# EAGLE design BLDC2 (EAGLE 9.6.2)
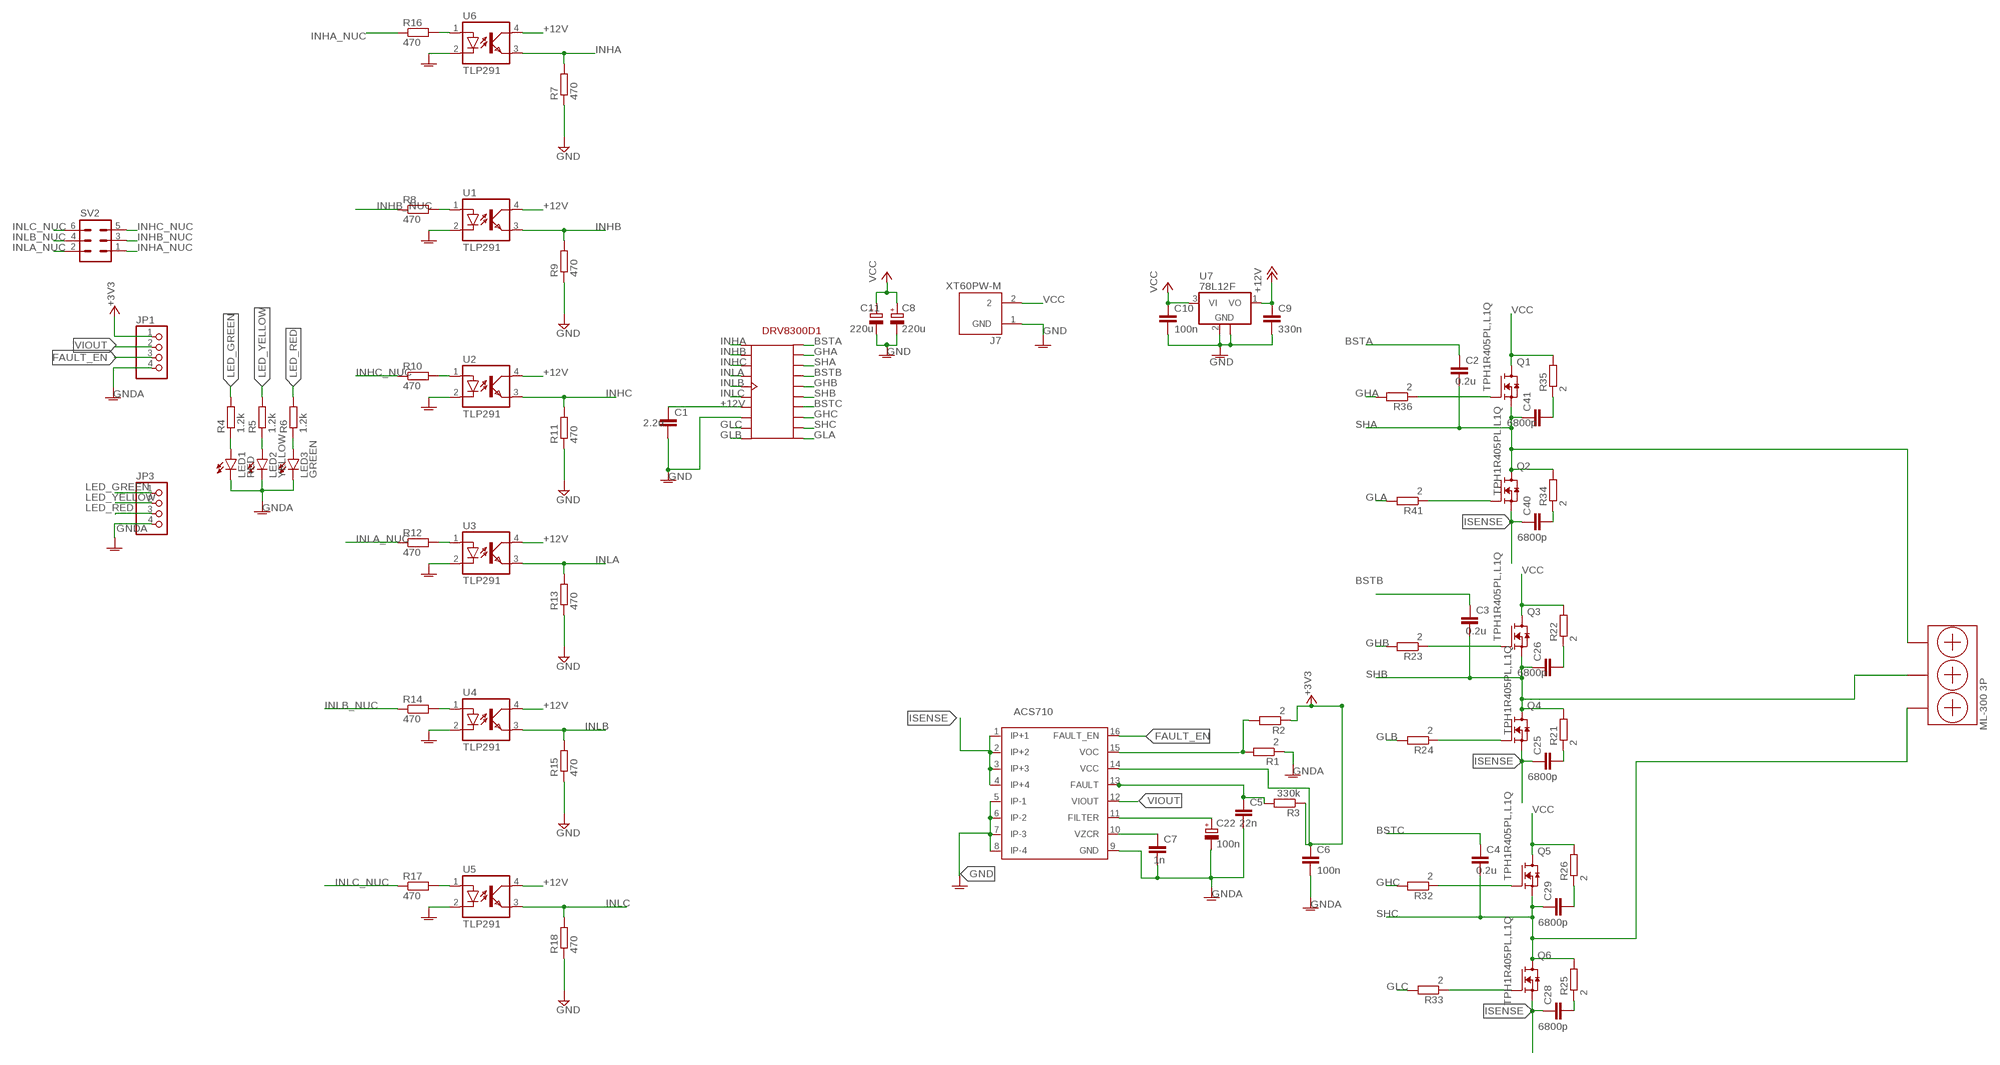
[diagram p0: schematic, sheet 1]

## Parts
C1  2.2u  C-EUC1206  [C1206]
C2  0.2u  C-EUC1206  [C1206]
C3  0.2u  C-EUC1206  [C1206]
C4  0.2u  C-EUC1206  [C1206]
C5  22n  C-EUC0603  [C0603]
C6  100n  C-EUC0603  [C0603]
C7  1n  C-EUC0603  [C0603]
C8  220u  CPOL-EUE5-10.5  [E5-10,5]
C9  330n  C-EUC0603  [C0603]
C10  100n  C-EUC0603  [C0603]
C11  220u  CPOL-EUE5-10.5  [E5-10,5]
C22  100n  CPOL-EUE2.5-5  [E2,5-5]
C25  6800p  C-EUC0603  [C0603]
C26  6800p  C-EUC0603  [C0603]
C28  6800p  C-EUC0603  [C0603]
C29  6800p  C-EUC0603  [C0603]
C40  6800p  C-EUC0603  [C0603]
C41  6800p  C-EUC0603  [C0603]
DRV8300D1  DRV8300D  [DRV8300D]
J7  XT60PW-M  [AMASS_XT60PW-M]
JP1  PINHD-1X4  [1X04]
JP3  PINHD-1X4  [1X04]
LED1  RED  LEDCHIP-LED0603  [CHIP-LED0603]
LED2  YELLOW  LEDCHIP-LED0603  [CHIP-LED0603]
LED3  GREEN  LEDCHIP-LED0603  [CHIP-LED0603]
ML-300-3P1  ML-300-3P  [ML300-3P]
Q1  TPH1R405PL,L1Q  [SOPADVANCE]
Q2  TPH1R405PL,L1Q  [SOPADVANCE]
Q3  TPH1R405PL,L1Q  [SOPADVANCE]
Q4  TPH1R405PL,L1Q  [SOPADVANCE]
Q5  TPH1R405PL,L1Q  [SOPADVANCE]
Q6  TPH1R405PL,L1Q  [SOPADVANCE]
R1  2  R-EU_R0603  [R0603]
R2  2  R-EU_R0603  [R0603]
R3  330k  R-EU_R0603  [R0603]
R4  1.2k  R-EU_R0603  [R0603]
R5  1.2k  R-EU_R0603  [R0603]
R6  1.2k  R-EU_R0603  [R0603]
R7  470  R-EU_R0603  [R0603]
R8  470  R-EU_R0603  [R0603]
R9  470  R-EU_R0603  [R0603]
R10  470  R-EU_R0603  [R0603]
R11  470  R-EU_R0603  [R0603]
R12  470  R-EU_R0603  [R0603]
R13  470  R-EU_R0603  [R0603]
R14  470  R-EU_R0603  [R0603]
R15  470  R-EU_R0603  [R0603]
R16  470  R-EU_R0603  [R0603]
R17  470  R-EU_R0603  [R0603]
R18  470  R-EU_R0603  [R0603]
R21  2  R-EU_R0603  [R0603]
R22  2  R-EU_R0603  [R0603]
R23  2  R-EU_R0603  [R0603]
R24  2  R-EU_R0603  [R0603]
R25  2  R-EU_R0603  [R0603]
R26  2  R-EU_R0603  [R0603]
R32  2  R-EU_R0603  [R0603]
R33  2  R-EU_R0603  [R0603]
R34  2  R-EU_R0603  [R0603]
R35  2  R-EU_R0603  [R0603]
R36  2  R-EU_R0603  [R0603]
R41  2  R-EU_R0603  [R0603]
SV2  MA03-2  [MA03-2]
U1  TLP291  [MINI-FLAT-4]
U2  TLP291  [MINI-FLAT-4]
U3  TLP291  [MINI-FLAT-4]
U4  TLP291  [MINI-FLAT-4]
U5  TLP291  [MINI-FLAT-4]
U6  TLP291  [MINI-FLAT-4]
U7  78L12F  [SOT89]
U$1  ACS710  [ACS710]

## Nets
+3V3: C6.1 JP1.1 R2.1 R3.1 U$1.14(VCC)
+12V: C1.1 C9.1 DRV8300D1.GVDD U1.4(COL) U2.4(COL) U3.4(COL) U4.4(COL) U5.4(COL) U6.4(COL) U7.1(VO)
AHG1 [gates]: Q1.4(G) R36.1
AHG3 [gates]: Q3.4(G) R23.1
AHG4 [gates]: Q5.4(G) R32.1
ALG1 [gates]: Q2.4(G) R41.1
ALG3 [gates]: Q4.4(G) R24.1
ALG4 [gates]: Q6.4(G) R33.1
BSTA [INS]: C2.1 DRV8300D1.BSTA
BSTB [INS]: C3.1 DRV8300D1.BSTB
BSTC [INS]: C4.1 DRV8300D1.BSTC
FAULT_EN: JP1.3 U$1.16(FAULT_EN)
GHA [INS]: DRV8300D1.GHA R36.2
GHB [INS]: DRV8300D1.GHB R23.2
GHC [INS]: DRV8300D1.GHC R32.2
GLA [INS]: DRV8300D1.GLA R41.2
GLB [INS]: DRV8300D1.GLB R24.2
GLC [INS]: DRV8300D1.GLC R33.2
GND: C1.2 C8.- C9.2 C10.2 C11.- DRV8300D1.GND J7.1(GND) R7.1 R9.1 R11.1 R13.1 R15.1 R18.1 U7.2(GND) U7.2@1(GND) U$1.5(IP-1) U$1.6(IP-2) U$1.7(IP-3) U$1.8(IP-4) ; supply symbol labelled GNDA
GNDA: C5.2 C6.2 C7.2 C22.- JP1.4 JP3.4 LED1.C LED2.C LED3.C R1.1 U1.2(C) U2.2(C) U3.2(C) U4.2(C) U5.2(C) U6.2(C) U$1.9(GND)
INHA [INS]: DRV8300D1.INHA R7.2 U6.3(EMIT)
INHA_NUC: R16.1 SV2.1
INHB [INS]: DRV8300D1.INHB R9.2 U1.3(EMIT)
INHB_NUC: R8.1 SV2.3
INHC [INS]: DRV8300D1.INHC R11.2 U2.3(EMIT)
INHC_NUC: R10.1 SV2.5
INLA [INS]: DRV8300D1.INLA R13.2 U3.3(EMIT)
INLA_NUC: R12.1 SV2.2
INLB [INS]: DRV8300D1.INLB R15.2 U4.3(EMIT)
INLB_NUC: R14.1 SV2.4
INLC [INS]: DRV8300D1.INLC R18.2 U5.3(EMIT)
INLC_NUC: R17.1 SV2.6
ISENSE: C25.1 C28.1 C40.1 Q2.1(S) Q2.2(S) Q2.3(S) Q4.1(S) Q4.2(S) Q4.3(S) Q6.1(S) Q6.2(S) Q6.3(S) U$1.1(IP+1) U$1.2(IP+2) U$1.3(IP+3) U$1.4(IP+4)
LED_GREEN: JP3.1 R4.2
LED_RED: JP3.3 R6.2
LED_YELLOW: JP3.2 R5.2
N$1: LED1.A R4.1
N$2: LED2.A R5.1
N$3: R1.2 R2.2 U$1.15(VOC)
N$4: C5.1 R3.2 U$1.13(FAULT)
N$5: C7.1 U$1.10(VZCR)
N$6: LED3.A R6.1
N$7: R8.2 U1.1(A)
N$8: R10.2 U2.1(A)
N$9: R12.2 U3.1(A)
N$10: R14.2 U4.1(A)
N$11: R17.2 U5.1(A)
N$17: C22.+ U$1.11(FILTER)
N$25: R16.2 U6.1(A)
N$36: C25.2 R21.1
N$37: C26.2 R22.1
N$39: C28.2 R25.1
N$40: C29.2 R26.1
N$42: C40.2 R34.1
N$43: C41.2 R35.1
SHA [gates]: C2.2 C41.1 DRV8300D1.SHA ML-300-3P1.P$1 Q1.1(S) Q1.2(S) Q1.3(S) Q2.5(D) Q2.6(D) Q2.7(D) Q2.8(D) Q2.9(D) R34.2
SHB [gates]: C3.2 C26.1 DRV8300D1.SHB ML-300-3P1.P$3 Q3.1(S) Q3.2(S) Q3.3(S) Q4.5(D) Q4.6(D) Q4.7(D) Q4.8(D) Q4.9(D) R21.2
SHC [INS]: C4.2 C29.1 DRV8300D1.SHC ML-300-3P1.P$5 Q5.1(S) Q5.2(S) Q5.3(S) Q6.5(D) Q6.6(D) Q6.7(D) Q6.8(D) Q6.9(D) R25.2
VCC: C8.+ C10.1 C11.+ J7.2 Q1.5(D) Q1.6(D) Q1.7(D) Q1.8(D) Q1.9(D) Q3.5(D) Q3.6(D) Q3.7(D) Q3.8(D) Q3.9(D) Q5.5(D) Q5.6(D) Q5.7(D) Q5.8(D) Q5.9(D) R22.2 R26.2 R35.2 U7.3(VI)
VIOUT: JP1.2 U$1.12(VIOUT)

## Library data of the parts
C1-C7 C9 C10 C25 C26 C28 C29 C40 C41 = rcl:C-EU: CAPACITOR, European symbol; SPICEPREFIX: C
C8 C11 C22 = rcl:CPOL-EU: POLARIZED CAPACITOR, European symbol; SPICEPREFIX: C
DRV8300D1 = DRV8300D:DRV8300D
J7 = con-xt:XT60PW-M; AVAILABILITY: Unavailable; MF: AMASS; MP: XT60PW-M; PACKAGE: Package Analog Devices; PRICE: None
JP1 JP3 = pinhead:PINHD-1X4: PIN HEADER
LED1-LED3 = led:LED: LED OSRAM: - CHIPLED LG R971, LG N971, LY N971, LG Q971, LY Q971, LO R971, LY R971 LH N974, LH R974 LS Q976, LO Q976, LY Q976 LO Q996 - Hyper CHIPLED LW Q18S LB Q993, LB Q99A, LB R99A - SideLED LS A670, LO A670, LY A670, LG A670, LP A670 LB A673, LV A673, LT A673, LW A673 LH A674 LY A675 LS A676, LA A676, LO A676, LY A676, LW A676 LS A679, LY A679, LG A679 - Hyper Micro SIDELED® LS Y876, LA Y876, LO Y876, LY Y876 LT Y87S - SmartLED LW L88C, LW L88S LB L89C, LB L89S, LG L890 LS L89K, LO L89K, LY L89K LS L896, LA L896, LO L896, LY L896 - TOPLED LS T670, LO T670, LY T670, LG T670, LP T670 LSG T670, LSP T670, LSY T670, LOP T670, LYG T670 LG T671, LOG T671, LSG T671 LB T673, LV T673, LT T673, LW T673 LH T674 LS T676, LA T676, LO T676, LY T676, LB T676, LH T676, LSB T676, LW T676 LB T67C, LV T67C, LT T67C, LS T67K, LO T67K, LY T67K, LW E67C LS E67B, LA E67B, LO E67B, LY E67B, LB E67C, LV E67C, LT E67C LW T67C LS T679, LY T679, LG T679 LS T770, LO T770, LY T770, LG T770, LP T770 LB T773, LV T773, LT T773, LW T773 LH T774 LS E675, LA E675, LY E675, LS T675 LS T776, LA T776, LO T776, LY T776, LB T776 LHGB T686 LT T68C, LB T68C - Hyper Mini TOPLED® LB M676 - Mini TOPLED Santana® LG M470 LS M47K, LO M47K, LY M47K Source: http://www.osram.convergy.de LUXEON: - LUMILED® LXK2-PW12-R00, LXK2-PW12-S00, LXK2-PW14-U00, LXK2-PW14-V00 LXK2-PM12-R00, LXK2-PM12-S00, LXK2-PM14-U00 LXK2-PE12-Q00, LXK2-PE12-R00, LXK2-PE12-S00, LXK2-PE14-T00, LXK2-PE14-U00 LXK2-PB12-K00, LXK2-PB12-L00, LXK2-PB12-M00, LXK2-PB14-N00, LXK2-PB14-P00, LXK2-PB14-Q00 LXK2-PR12-L00, LXK2-PR12-M00, LXK2-PR14-Q00, LXK2-PR14-R00 LXK2-PD12-Q00, LXK2-PD12-R00, LXK2-PD12-S00 LXK2-PH12-R00, LXK2-PH12-S00 LXK2-PL12-P00, LXK2-PL12-Q00, LXK2-PL12-R00 Source: www.luxeon.com KINGBRIGHT: KA-3528ASYC Source: www.kingbright.com
ML-300-3P1 = ML-300-3P:ML-300-3P
Q1-Q6 = toshiba:TPH1R405PL,L1Q; SPICEPREFIX: Q
R1-R18 R21-R26 R32-R36 R41 = rcl:R-EU_: RESISTOR, European symbol; SPICEPREFIX: R
SV2 = con-lstb:MA03-2: PIN HEADER; OC_FARNELL: unknown; OC_NEWARK: unknown
U1-U6 = toshiba:TLP291: TOSHIBA PHOTOCOUPLER GaAs IRED & PHOTO-TRANSISTOR; OC_FARNELL: unknown; OC_NEWARK: unknown
U7 = linear:78L*: POSITOIV-VOLTAGE REGULATORS Output up to 100 mA Source: Datasheet <http://focus.ti.com/lit/ds/symlink/ua78l05.pdf>
U$1 = ACS710:ACS710

## Net classes
0 default: width 0.5 mm
1 INS: width 0.4 mm

## Board
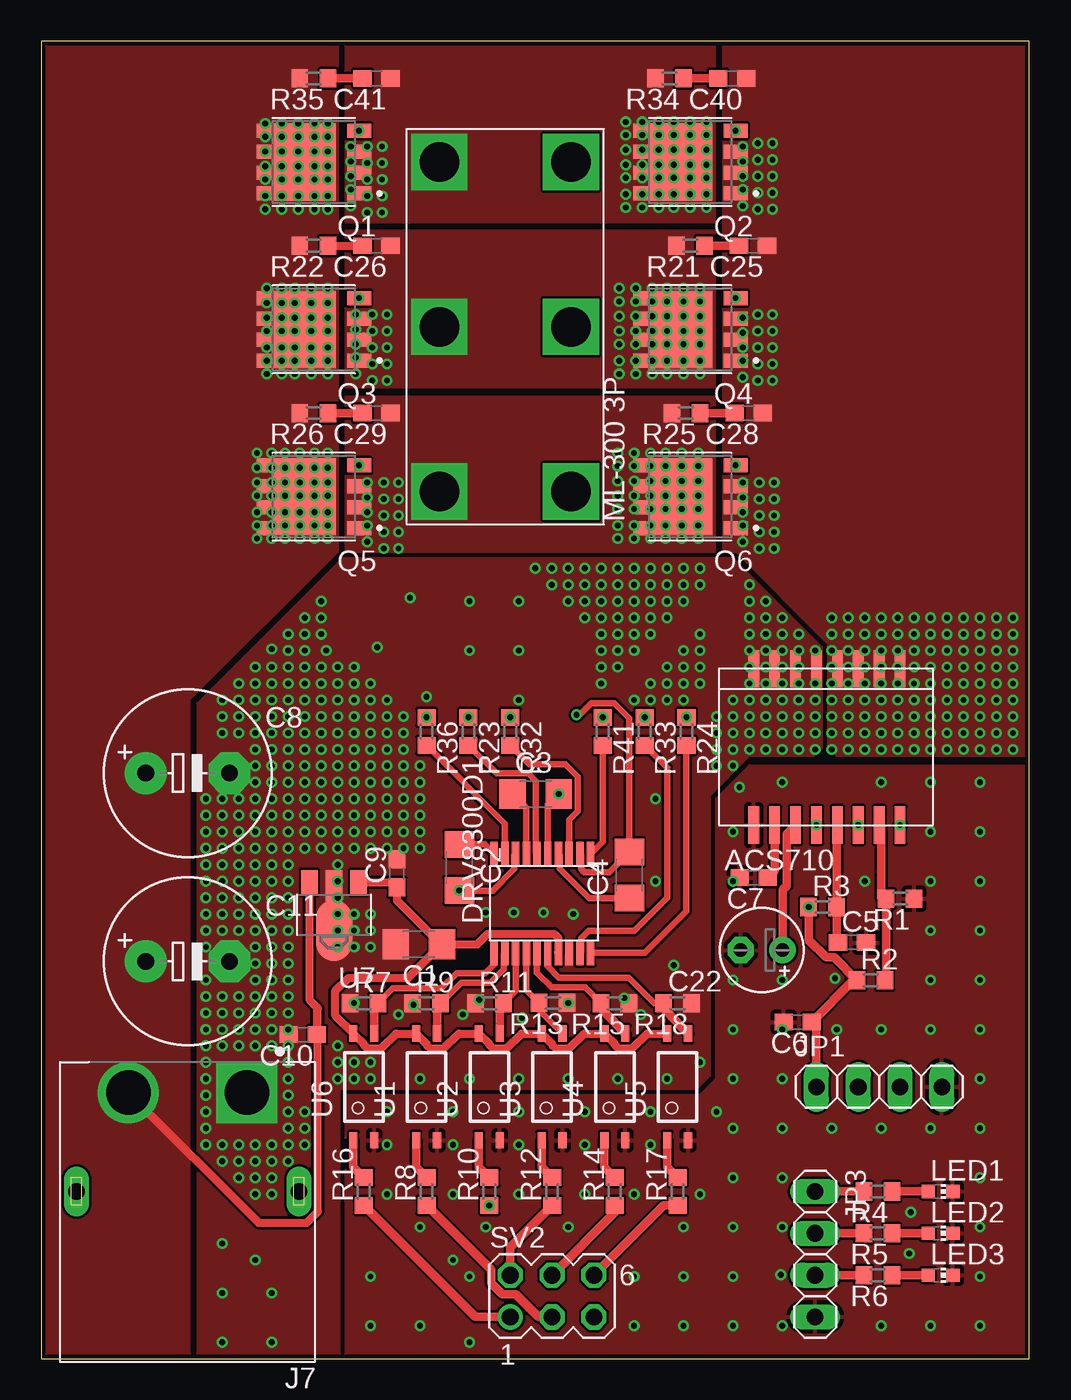
[diagram p1: board, top side]
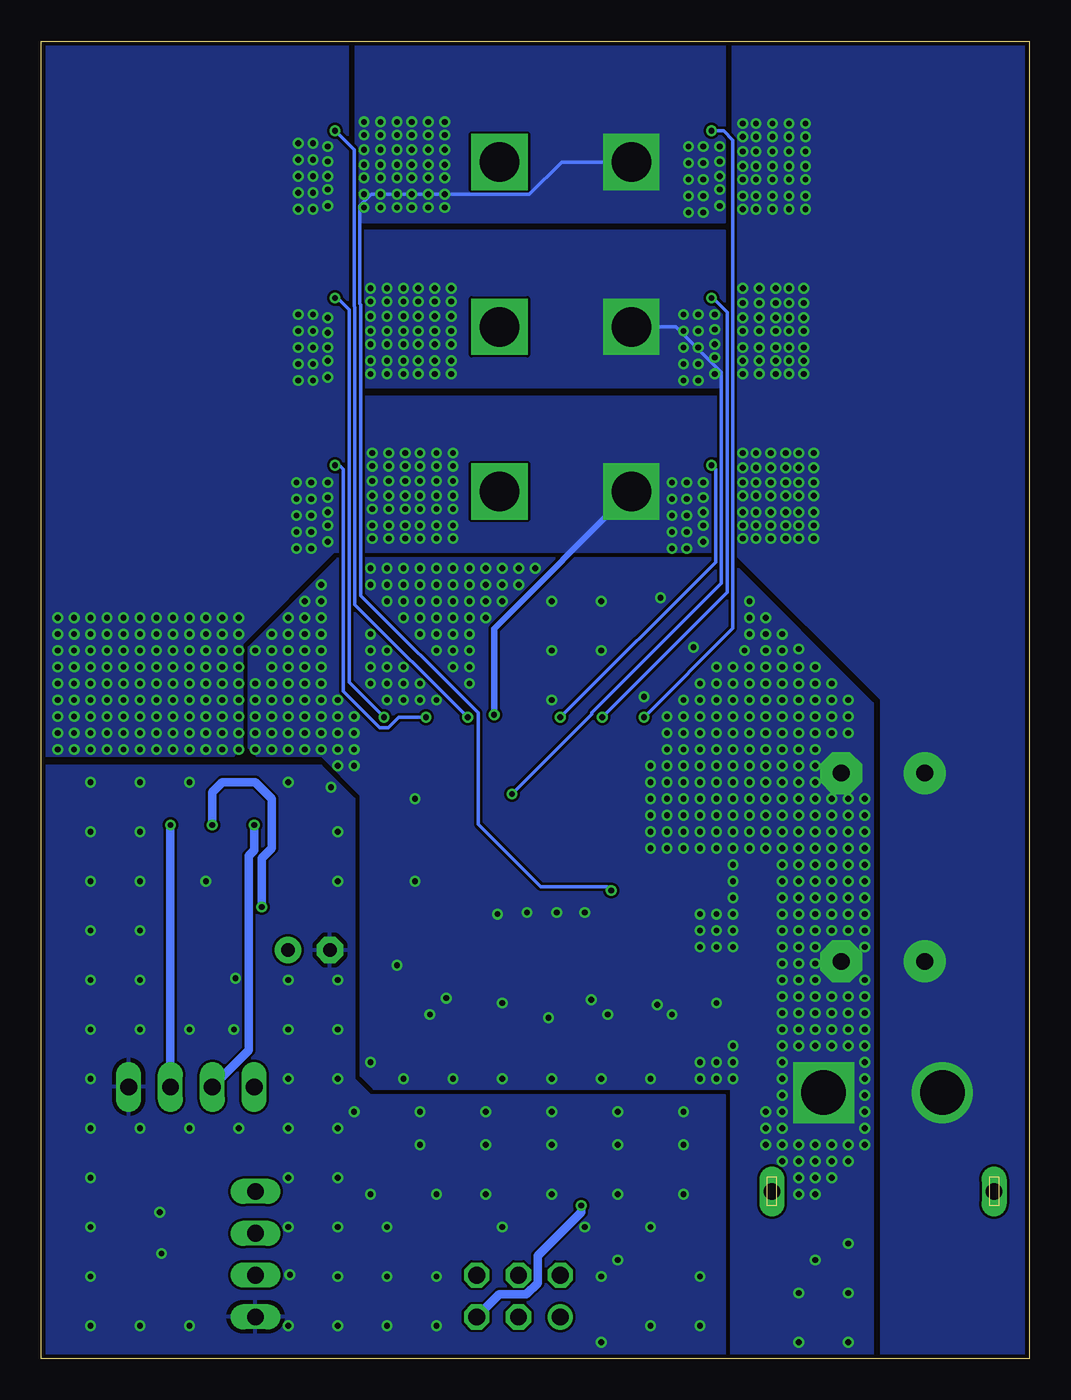
[diagram p2: board, bottom side, seen from below]

Size 60 x 80 mm. Coordinates in mm from the lower left corner, seen from the top.
Outline: 0,0 60,0 60,80 0,80 0,0
Copper layers (1*16): Top 0.035mm / dielectric 1.5mm / Bottom 0.035mm
Design rules "SeeedStudio_2layer_DRU_no_angle_20140221": minimum track width 6mil, minimum drill 12mil, track to track 6mil, track to pad 6mil, pad to pad 6mil, via to via 6mil, smd to smd 0mil, copper to edge 10mil, drill to drill 10mil, minimum pad ring 10mil, minimum via ring 6mil, stop-mask expansion 2mil, vias tented up to drill 100mil, thermal gap 10mil

### Footprints (pad centres in the part's own frame; a part is rotated, then mirrored left to right if it is on the bottom)
C1206 = smd 1.6 x 1.8: 1 -1.4,0; 2 1.4,0
C0603 = smd 1.1 x 1: 1 -0.85,0; 2 0.85,0
E5-10,5 = drill 1.016 pad 2.54: + -2.54,0 | drill 1.016 pad 2.54 octagon: - 2.54,0
E2,5-5 = drill 0.813 pad 1.6: + -1.27,0 | drill 0.813 pad 1.6 octagon: - 1.27,0
DRV8300D = smd 1.5 x 0.45: BSTA 5.25,6.325; BSTB 5.25,4.375; BSTC 5.25,2.425; GHA 5.25,5.675; GHB 5.25,3.725; GHC 5.25,1.775; GLA 5.25,0.475; GLB -0.75,0.475; GLC -0.75,1.125; GND -0.75,1.775; GVDD -0.75,2.425; INHA -0.75,6.325; INHB -0.75,5.675; INHC -0.75,5.025; INLA -0.75,4.375; INLB -0.75,3.725; INLC -0.75,3.075; SHA 5.25,5.025; SHB 5.25,3.075; SHC 5.25,1.125
AMASS_XT60PW-M = drill 2.7 square: 1 -3.6,-6 | drill 2.7: 2 3.6,-6 | drill 1 pad 1.2 long: S1 -6.75,0; S2 6.75,0
1X04 = drill 1.016 long: 1 -3.81,0; 2 -1.27,0; 3 1.27,0; 4 3.81,0
CHIP-LED0603 = smd 0.8 x 0.8: A 0,-0.75; C 0,0.75
ML300-3P = drill 2.4 square: P$1 0,0; P$2 0,8; P$3 10,0; P$4 10,8; P$5 20,0; P$6 20,8
SOPADVANCE = smd 1.45 x 0.85: 1 -2.75,1.905; 2 -2.75,0.635; 3 -2.75,-0.635; 4 -2.75,-1.905 | smd 1.05 x 0.85: 5 2.95,-1.905; 6 2.95,-0.635; 7 2.95,0.635; 8 2.95,1.905 | smd 3.75 x 4.7: 9 0.55,0
R0603 = smd 1 x 1.1: 1 -0.85,0; 2 0.85,0
MA03-2 = drill 1.016: 1 -2.54,-1.27 | drill 1.016 octagon: 2 -2.54,1.27; 3 0,-1.27; 4 0,1.27; 5 2.54,-1.27; 6 2.54,1.27
MINI-FLAT-4 = smd 1 x 0.5: 1 -3.24,0.635; 2 -3.24,-0.635; 3 3.24,-0.635; 4 3.24,0.635
SOT89 = smd 1 x 1.5: 1 -1.499,-1.981; 3 1.499,-1.981 | smd 1 x 2: 2 0,-1.727 | smd 2.2 x 3.7: 2@1 0,0.94
ACS710 = smd 0.65 x 2.25: 1 0,0; 2 1.27,0; 3 2.54,0; 4 3.81,0; 5 5.08,0; 6 6.35,0; 7 7.62,0; 8 8.89,0; 9 8.89,9.5; 10 7.62,9.5; 11 6.35,9.5; 12 5.08,9.5; 13 3.81,9.5; 14 2.54,9.5; 15 1.27,9.5; 16 0,9.5

### Placement (x,y rotation side)
C1  22.93,25.17 180 top
C2  25.39,29.83 270 top
C3  30.02,34.29 0 top
C4  35.71,29.37 90 top
C5  49.23,25.27 0 top
C6  45.93,20.45 180 top
C7  43.26,29.21 180 top
C8  8.89,35.56 0 top
C9  21.59,29.48 90 top
C10  15.89,19.68 180 top
C11  8.89,24.13 0 top
C22  43.74,24.82 180 top
C25  43.22,67.58 180 top
C26  20.36,67.58 180 top
C28  42.95,57.42 180 top
C29  20.36,57.42 180 top
C40  41.95,77.74 180 top
C41  20.36,77.74 180 top
DRV8300D1  33.83,25.4 90 top
J7  8.89,10.16 180 top
JP1  50.88,16.51 0 top
JP3  46.99,6.35 270 top
LED1  54.61,10.16 270 top
LED2  54.61,7.62 270 top
LED3  54.61,5.08 270 top
ML-300-3P1  24.17,72.66 270 top
Q1  16.55,72.66 180 top
Q2  39.41,72.66 180 top
Q3  16.55,62.5 180 top
Q4  39.41,62.5 180 top
Q5  16.55,52.34 180 top
Q6  39.41,52.34 180 top
R1  52.15,27.94 180 top
R2  50.37,22.99 0 top
R3  47.45,27.43 0 top
R4  50.8,10.16 180 top
R5  50.8,7.62 180 top
R6  50.8,5.08 180 top
R7  19.59,21.59 0 top
R8  23.4,10.16 90 top
R9  23.4,21.59 0 top
R10  27.21,10.16 90 top
R11  27.21,21.59 0 top
R12  31.02,10.16 90 top
R13  31.08,21.61 180 top
R14  34.83,10.16 90 top
R15  34.83,21.59 180 top
R16  19.59,10.16 90 top
R17  38.64,10.16 90 top
R18  38.64,21.59 180 top
R21  39.41,67.58 180 top
R22  16.55,67.58 180 top
R23  25.94,38.1 270 top
R24  39.18,38.1 270 top
R25  39.14,57.42 180 top
R26  16.55,57.42 180 top
R32  28.48,38.1 270 top
R33  36.64,38.1 270 top
R34  38.14,77.74 180 top
R35  16.55,77.74 180 top
R36  23.4,38.1 270 top
R41  34.1,38.1 270 top
SV2  31.02,3.81 0 top
U1  23.4,16.51 90 top
U2  27.21,16.51 90 top
U3  31.02,16.51 90 top
U4  34.83,16.51 90 top
U5  38.64,16.51 90 top
U6  19.59,16.51 90 top
U7  17.78,26.94 180 top
U$1  52.15,41.91 180 top

### Tracks (layer width: path | path; a pad name or v marks a point on that pad's centre or on a via)
+3V3  (via drill 0.35)
  Top 0.508: JP1.1 47.07,20.15 C6.1 49.32,22.99 R2.1 48.14,24.37 47.66,24.37 46.6,25.43 R3.1
  Bottom 0.508: R3.1 46.6,30.4 46,31 46,34 47,35 49,35 49.61,34.39 U$1.14
  other vias: 46.6,27.43 49.61,32.41
+12V
  Top 0.5: U7.1 21.3,28.92 C9.1 21.59,27.83 24.25,25.17 C1.1 | DRV8300D1.GVDD 31.38,24.67 31.38,25.57 31.15,25.8 27.11,25.8 26.48,25.17 C1.1 | C1.1 22.26,23.1 18.63,23.1 17.84,22.31 17.84,20.87 U6.4 19.57,19.13 19.57,19.08 19.81,18.85 20.64,18.85 21.54,19.75 U1.4 23.38,19.13 23.38,19.08 23.62,18.85 24.45,18.85 25.35,19.75 U2.4 27.19,19.13 27.19,19.08 27.43,18.85 28.26,18.85 29.16,19.75 U3.4 31,19.13 31,19.08 31.24,18.85 32.07,18.85 32.97,19.75 U4.4 34.81,19.13 34.81,19.08 35.05,18.85 35.88,18.85 36.78,19.75 U5.4
AHG1  (via drill 0.35)
  Bottom 0.2: R36.1 18,44.35 18,74 18.57,74.56 Q1.4
  other vias: 23.4,38.95 19.3,74.56
AHG3  (via drill 0.35)
  Bottom 0.2: R23.1 18.35,46.54 18.35,63.55 19.2,64.41 Q3.4
  other vias: 25.94,38.95 19.3,64.41
AHG4  (via drill 0.35)
  Bottom 0.152: 19.06,54 v19.3,54.24
  Bottom 0.2: R32.1 19.06,48.37 19.06,54
  other vias: 28.48,38.95
ALG1  (via drill 0.35)
  Bottom 0.2: R41.1 40.95,45.8 40.95,63.85 41,63.9 41,73.41 Q2.4
  other vias: 34.1,38.95 42.16,74.56
ALG3  (via drill 0.35)
  Bottom 0.2: R24.1 41.3,41.07 41.3,63.7 42.01,64.41 Q4.4
  other vias: 39.18,38.95 42.16,64.41
ALG4  (via drill 0.35)
  Bottom 0.2: R33.1 38.29,38.95 38.92,38.32 39.44,38.32 41.65,40.53 41.65,54 41.9,54.24 v42.16,54.24
  other vias: 36.64,38.95
BSTA
  Top 0.4: C2.1 26.93,31.23 DRV8300D1.BSTA
BSTB
  Top 0.4: DRV8300D1.BSTB 29.45,33.45 C3.1
BSTC
  Top 0.4: DRV8300D1.BSTC 31.48,30.58 31.48,29.75 33.26,27.97 C4.1
FAULT_EN  (via drill 0.35)
  Bottom 0.508: U$1.16 JP1.3
  other vias: 52.15,32.41
GHA
  Top 0.4: R36.2 28.16,32.49 DRV8300D1.GHA
GHB
  Top 0.4: DRV8300D1.GHB 30.03,30.72 30.03,35.08 29.57,35.54 27.65,35.54 R23.2
GHC
  Top 0.4: R32.2 29.64,36.09 31.81,36.09 32.57,35.34 32.57,33.24 32.05,32.73 DRV8300D1.GHC
GLA
  Top 0.4: DRV8300D1.GLA 34.1,31.39 R41.2
GLB
  Top 0.4: DRV8300D1.GLB 36.65,24.65 39.18,27.18 R24.2
GLC
  Top 0.4: DRV8300D1.GLC 32.78,24.72 32.78,25.55 33.23,26 36,26 38,28 38,35.89 R33.2
GND  (via drill 0.35)
  other vias: 19,21.6 21.7,20.9 22.6,21.5 25.6,20.9 26.6,21.8 32,21.6 35.4,21.9 36.4,20.9 29.2,20.7 17,34 20,34 20,37 17,37 27,27.1 28.7,27.1 30.5,27.1 32.3,27 13,6 17,40 20,40 14,40 14,37 14,34 14,31 17,31 20,31 14,28 14,25 11,28 11,31 11,40 23,34 23,31 14,22 11,22 11,19 14,19 11,13 14,13 14,10 11,7 11,4 14,4 14,1 11,1 38.4,23.9 37.3,34 37.3,29 17.3,43 14,43.1 17,46 20.4,43.2 22.4,46.2 23.4,40.2 26,43 29,43 26,46 29,46 29,40 32,46 35,46 35,43 38,46 39,43 38,41 43,46 43,43 46,43 46,40 43,40 43,37 46,37 45,40 46,39 46,38 45,38 45,37 45,39 44,40 44,39 43,39 43,38 44,38 44,37 43,41 44,41 45,41 46,41 47,41 47,40 47,39 47,38 47,37 44,42 45,42 46,42 43,42 44,43 45,43 47,43 43,44 43,45 44,45 44,46 45,45 44,44 45,44 46,44 43,47 42,39 42,38 42,37 42,36 41,36 41,37 41,38 41,39 42,40 39,46 40,47 40,48 38,45 37,44 36,43 35,42 34,41 34,42 34,43 34,44 35,44 36,44 36,45 37,45 35,45 34,45 33,45 33,46 34,46 36,46 37,46 31,47 30,48 31,48 32,48 32,47 33,47 33,48 34,48 34,47 35,47 35,48 36,48 36,47 37,47 37,48 39,47 38,47 38,48 39,48 37,41 39,41 39,42 38,42 40,43 40,44 40,42 40,41 39,40 38,40 37,40 36,40 18,28 18,29 18,30 18,27 18,26 18,25 19,25 19,26 19,27 20,27 20,26 20,25 16,45 15,44 16,44 17,44 17,45 18,42 19,42 19,41 18,41 18,40 19,40 20,41 21,40 22,39 21,39 21,38 22,38 22,37 21,37 20,38 20,39 19,39 19,38 19,37 18,37 18,38 18,39 17,39 17,38 17,41 17,42 16,43 15,43 15,42 16,42 16,41 15,41 15,40 16,40 16,39 15,39 15,38 15,37 16,38 16,37 22,36 21,36 20,36 19,36 18,36 17,36 16,36 15,36 14,36 14,38 14,39 14,41 14,42 13,42 13,41 13,40 12,40 12,41 11,39 12,39 13,39 13,38 12,38 11,38 13,37 13,35 13,36 14,35 15,35 16,35 17,35 18,35 16,34 15,34 18,34 19,34 19,35 20,35 21,35 22,35 22,34 21,34 13,34 12,33 11,33 11,32 10,32 10,33 10,34 11,34 12,34 13,33 14,33 13,32 12,32 15,33 15,32 14,32 16,32 16,33 17,33 17,32 18,32 18,33 19,33 19,32 20,32 20,33 21,33 21,32 22,32 22,33 23,33 23,32 12,31 13,31 10,31 15,31 16,31 18,31 19,31 21,31 22,31 10,30 11,30 12,30 13,30 14,30 15,30 10,29 11,29 12,29 13,29 14,29 15,29 12,28 13,28 10,28 10,27 11,27 12,27 13,27 14,27 15,28 15,27 15,26 14,26 13,26 15,25 15,24 13,25 13,24 14,24 14,23 15,23 13,23 13,22 12,22 15,22 10,22 10,26 11,26 12,26 10,23 10,25 11,21 12,21 13,21 14,21 15,21 15,20 14,20 15,19 13,19 13,20 12,20 11,20 12,19 10,19 10,20 10,21 10,18 10,17 15,18 15,17 15,16 15,15 15,14 15,13 13,13 12,13 10,13 10,14 10,15 10,16 12,12 11,12 12,11 13,11 13,10 14,11 14,12 13,12 15,12 16,15 16,14 16,13 23,36 23,35 18,19 18,18 19,18 20,18 18,17 19,17 20,17 23,17 26,17 29,17 32,17 35,17 38,17 40,18
  pour Top (no thermals): 18.1,0 9.5,0 9.5,39.8 18.3,48.6 42,48.6 47.4,43.2 47.4,37.1 46.9,36.6 43,36.6 40.6,34.2 40.6,17.2 39.8,16.4 18.1,16.4
  pour Bottom (no thermals): 18.1,-0.03 9.5,-0.03 9.5,39.8 18.3,48.6 42,48.6 47.4,43.2 47.4,37.1 46.9,36.6 43,36.6 40.6,34.2 40.6,17.2 39.8,16.4 18.1,16.4
GNDA  (via drill 0.35)
  other vias: 20,2 20,5 23,2 45,20 45,23 42,20 42,23 45,14 45,17 42,14 42,17 42,8 42,11 45,8 45,11 45,2 44.9,5.1 42,2 42,5 39,2 39,5 36,2 36,5 57,20 48.2,23.1 57,23 54,23 51,20 48.3,20 57,26 54,26 57,29 54,29 54,32 57,32 50,29 57,35 54,35 51,35 45,35 42.4,34.7 42,29 42,32 54,20 57,17 57,14 54,14 51,14 48,14 57,11 57,8 57,5 57,2 54,2 51,2 52.7,6.4 52.8,8.9 23,8 25,6 26,5 26,1 27,8 32,8 33,10 29,10 25,10 21,10 36,10 40,10 33,13 37,13 29,13 25,13 21,13 21,15 25,15 29,15 33,15 37,15 41,15 39,8
  pour Top: 18.5,0 18.5,16 40,16 41,17 41,34 43,36 60,36 60,0
  pour Bottom: 18.5,0 18.5,16 40,16 41,17 41,34 43,36 60,36 60,0
INHA
  Top 0.4: R7.2 21.35,22.5 24.3,22.5 25.22,23.42 26.98,23.42 27.5,23.95 DRV8300D1.INHA
  Top 0.508: U6.3 20.23,21.38 R7.2
INHA_NUC
  Top 0.508: R16.1 26.36,2.54 SV2.1
INHB
  Top 0.4: DRV8300D1.INHB 28.08,24.58 28.08,23.65 27.28,22.85 25.51,22.85 R9.2
  Top 0.508: U1.3 24.04,21.38 R9.2
INHB_NUC
  Top 0.508: SV2.3 30.17,2.54 28.8,3.91 28,3.91 27.31,4.6 27.31,5.4 R8.1
INHC
  Top 0.4: R11.2 28.8,22.34 DRV8300D1.INHC
  Top 0.508: U2.3 27.84,21.38 R11.2
INHC_NUC  (via drill 0.35)
  Bottom 0.508: R10.1 27.21,8.89 29.85,6.25 29.85,4.6 30.54,3.91 32.19,3.91 SV2.5
  other vias: 27.21,9.31
INLA
  Top 0.4: DRV8300D1.INLA 29.45,22.39 R13.2 30.23,21.18 U3.3
INLA_NUC
  Top 0.508: SV2.2 28.48,6.77 R12.1
INLB
  Top 0.4: R15.2 33.02,22.55 30.98,22.55 30.08,23.45 30.08,24.62 DRV8300D1.INLB
  Top 0.508: U4.3 34.85,20.36 34.85,20.42 33.98,21.29 R15.2
INLB_NUC
  Top 0.508: SV2.4 34.83,8.89 R14.1
INLC
  Top 0.4: R18.2 37.23,21.59 35.67,23.15 31.43,23.15 30.73,23.85 30.73,24.62 DRV8300D1.INLC
  Top 0.508: U5.3 38.66,20.36 38.66,20.42 37.79,21.29 R18.2
INLC_NUC
  Top 0.508: SV2.6 37.79,9.31 R17.1
ISENSE  (via drill 0.35)
  other vias: 42.6,53.2 42.6,52.3 42.6,51.4 42.6,50.6 42.6,49.6 42.6,63.2 42.6,62.3 42.6,61.4 42.6,60.6 42.6,59.6 42.6,73.6 42.6,72.7 42.6,71.8 42.6,71 42.6,70 49,37 49,38 48,38 48,39 49,39 48,37 49,40 48,40 49,41 48,41 48,42 49,42 50,42 50,41 51,41 51,42 52,41 53,41 53,42 52,42 50,40 50,39 50,38 50,37 51,37 51,38 52,38 52,37 53,37 53,38 53,39 52,39 51,39 51,40 52,40 53,40 55,43 54,43 54,44 55,44 55,45 54,45 56,45 56,44 56,43 57,43 58,43 59,43 59,44 58,44 57,44 57,45 58,45 59,45 55,40 54,40 54,41 55,41 55,42 54,42 56,42 56,41 56,40 57,40 58,40 59,40 59,41 58,41 57,41 57,42 58,42 59,42 55,37 54,37 54,38 55,38 55,39 54,39 56,39 56,38 56,37 57,37 58,37 59,37 59,38 58,38 57,38 57,39 58,39 59,39 49,43 48,43 48,44 49,44 49,45 48,45 50,45 50,44 50,43 51,43 52,43 53,43 53,44 52,44 51,44 51,45 52,45 53,45 43.6,51.2 43.6,52.2 43.6,53.2 43.6,49.2 43.6,50.2 44.5,51.2 44.5,52.2 44.5,53.2 44.5,49.2 44.5,50.2 43.5,61.4 43.5,62.4 43.5,63.4 43.5,59.4 43.5,60.4 44.4,61.4 44.4,62.4 44.4,63.4 44.4,59.4 44.4,60.4 43.5,71.8 43.5,72.8 43.5,73.8 43.5,69.8 43.5,70.8 44.4,69.8 44.4,70.8 44.4,71.8 44.4,72.8 44.4,73.8
  pour Top (no thermals): 41.4,49 41.4,80 60,80 60,36.6 48.3,36.6 47.8,37.1 47.8,43.4 42.2,49
  pour Bottom (no thermals): 41.4,49 41.4,80 60,80 60,36.6 48.3,36.6 47.8,37.1 47.8,43.4 42.2,49
LED_GREEN
  Top 0.508: JP3.1 R4.2
LED_RED
  Top 0.508: JP3.3 R6.2
LED_YELLOW
  Top 0.508: JP3.2 R5.2
N$1
  Top 0.508: R4.1 LED1.A
N$2
  Top 0.508: R5.1 LED2.A
N$3
  Top 0.508: U$1.15 51,32.29 51,28 51.06,27.94 R1.2 51.3,23.07 R2.2
N$4
  Top 0.508: C5.1 48.3,25.35 R3.2 48.3,32.37 U$1.13
N$5
  Top 0.508: C7.1 44.53,29.63 U$1.10
N$6
  Top 0.508: R6.1 LED3.A
N$7
  Top 0.508: R8.2 22.77,11.64 U1.1
N$8
  Top 0.508: R10.2 26.57,11.64 U2.1
N$9
  Top 0.508: R12.2 30.39,11.64 U3.1
N$10
  Top 0.508: R14.2 34.2,11.64 U4.1
N$11
  Top 0.508: R17.2 38.01,11.64 U5.1
N$17
  Top 0.508: C22.+ 45.01,28.48 45.26,28.74 45.26,31.87 U$1.11
N$25
  Top 0.508: R16.2 18.95,11.64 U6.1
N$36
  Top 0.508: R21.1 C25.2
N$37
  Top 0.5: R22.1 C26.2
N$39
  Top 0.508: R25.1 C28.2
N$40
  Top 0.508: R26.1 C29.2
N$42
  Top 0.508: R34.1 C40.2
N$43
  Top 0.508: R35.1 C41.2
SHA  (via drill 0.35)
  Top 0.4: DRV8300D1.SHA 28.73,30.58 28.73,29.75 27.41,28.43 C2.2
  Bottom 0.2: C2.2 25.62,28.66 29.68,28.66 33.47,32.45 33.47,39.21 40.59,46.34 40.59,63.99 40.65,64.04 40.65,70 39.95,70.7 30.36,70.7 28.4,72.66 ML-300-3P1.P$1
  other vias: 25.39,28.43 18.8,73.6 18.8,72.7 18.8,71.8 18.8,71 18.8,70 19.8,71.6 19.8,72.6 19.8,73.6 19.8,69.6 19.8,70.6 20.7,71.6 20.7,72.6 20.7,73.6 20.7,69.6 20.7,70.6 37.5,74.3 37.5,73.4 37.5,72.5 37.5,71.7 37.5,70.7 36.5,74.3 36.5,73.4 36.5,72.5 36.5,71.7 36.5,70.7 35.5,74.3 35.5,73.4 35.5,72.5 35.5,71.7 35.5,70.7 37.5,69.9 36.5,69.9 35.5,69.9 37.5,75.1 36.5,75.1 35.5,75.1 40.4,74.3 40.4,73.4 40.4,72.5 40.4,71.7 40.4,70.7 39.4,74.3 39.4,73.4 39.4,72.5 39.4,71.7 39.4,70.7 38.4,74.3 38.4,73.4 38.4,72.5 38.4,71.7 38.4,70.7 40.4,69.9 39.4,69.9 38.4,69.9 40.4,75.1 39.4,75.1 38.4,75.1
  pour Top (no thermals): 18.5,69 40.9,69 40.9,80 18.5,80
  pour Bottom (no thermals): 18.5,69 40.9,69 40.9,80 18.5,80
SHB  (via drill 0.35)
  Top 0.4: DRV8300D1.SHB 30.75,33.62 C3.2
  Bottom 0.2: C3.2 26.57,39.14 26.57,39.21 18.7,47.08 18.7,59.91 21.46,62.66 ML-300-3P1.P$3
  other vias: 31.42,34.29 19.1,63.4 19.1,62.5 19.1,61.6 19.1,60.8 19.1,59.8 20.1,61.4 20.1,62.4 20.1,63.4 20.1,59.4 20.1,60.4 21,61.4 21,62.4 21,63.4 21,59.4 21,60.4 37.1,64.2 37.1,63.3 37.1,62.4 37.1,61.6 37.1,60.6 36.1,64.2 36.1,63.3 36.1,62.4 36.1,61.6 36.1,60.6 35.1,64.2 35.1,63.3 35.1,62.4 35.1,61.6 35.1,60.6 37.1,59.8 36.1,59.8 35.1,59.8 37.1,65 36.1,65 35.1,65 40,64.2 40,63.3 40,62.4 40,61.6 40,60.6 39,64.2 39,63.3 39,62.4 39,61.6 39,60.6 38,64.2 38,63.3 38,62.4 38,61.6 38,60.6 40,59.8 39,59.8 38,59.8 40,65 39,65 38,65
  pour Top (no thermals): 18.5,59 40.9,59 40.9,68.5 18.5,68.5
  pour Bottom (no thermals): 18.5,59 40.9,59 40.9,68.5 18.5,68.5
SHC  (via drill 0.35)
  Top 0.4: DRV8300D1.SHC 32.78,30.58 32.78,29.75 32.98,29.55 34.49,29.55 C4.2 35.71,38.89 34.8,39.8 33.4,39.8 32.7,39.1 v32.5,39.1
  Bottom 0.4: v32.5,39.1 32.5,44.33 ML-300-3P1.P$5
  other vias: 19.8,53.2 19.8,52.3 19.8,51.4 19.8,50.6 19.8,49.6 20.8,51.2 20.8,52.2 20.8,53.2 20.8,49.2 20.8,50.2 21.7,51.2 21.7,52.2 21.7,53.2 21.7,49.2 21.7,50.2 37,54.2 37,53.3 37,52.4 37,51.6 37,50.6 36,54.2 36,53.3 36,52.4 36,51.6 36,50.6 35,54.2 35,53.3 35,52.4 35,51.6 35,50.6 37,49.8 36,49.8 35,49.8 37,55 36,55 35,55 39.9,54.2 39.9,53.3 39.9,52.4 39.9,51.6 39.9,50.6 38.9,54.2 38.9,53.3 38.9,52.4 38.9,51.6 38.9,50.6 37.9,54.2 37.9,53.3 37.9,52.4 37.9,51.6 37.9,50.6 39.9,49.8 38.9,49.8 37.9,49.8 39.9,55 38.9,55 37.9,55
  pour Top (no thermals): 18.5,49 40.9,49 40.9,58.4 18.5,58.4
  pour Bottom (no thermals): 18.5,49 40.9,49 40.9,58.4 18.5,58.4
VCC  (via drill 0.35)
  Top 0.5: J7.2 13.2,8.25 16.12,8.25 16.8,8.93 16.8,21.28 16.72,21.36 | 16.72,21.36 16.74,21.35 C10.1 | U7.3 16.28,27.38 16.28,27.37 16.28,21.8 16.72,21.36
  other vias: 16.6,74.2 16.6,73.3 16.6,72.4 16.6,71.6 16.6,70.6 15.6,74.2 15.6,73.3 15.6,72.4 15.6,71.6 15.6,70.6 14.6,74.2 14.6,73.3 14.6,72.4 14.6,71.6 14.6,70.6 13.6,74.2 13.6,73.3 13.6,72.4 13.6,71.6 13.6,70.6 17.4,65 17.4,64.1 17.4,63.2 17.4,62.4 17.4,61.4 16.4,65 16.4,64.1 16.4,63.2 16.4,62.4 16.4,61.4 15.4,65 15.4,64.1 15.4,63.2 15.4,62.4 15.4,61.4 15.4,60.6 16.4,60.6 17.4,60.6 17.4,59.8 16.4,59.8 15.4,59.8 14.6,59.8 14.6,60.6 14.6,61.4 14.6,62.4 14.6,63.2 14.6,64.1 14.6,65 13.7,59.8 13.7,60.6 13.7,61.4 13.7,62.4 13.7,63.2 13.7,64.1 13.7,65 16.6,69.8 15.6,69.8 14.6,69.8 13.6,69.8 16.6,75 15.6,75 14.6,75 13.6,75 17.4,74.2 17.4,73.3 17.4,72.4 17.4,71.6 17.4,70.6 17.4,69.8 17.4,75 14.8,55 14.8,54.1 14.8,53.2 14.8,52.4 14.8,51.4 14.8,50.6 14.8,49.8 14,49.8 14,50.6 14,51.4 14,52.4 14,53.2 14,54.1 14,55 13.1,49.8 13.1,50.6 13.1,51.4 13.1,52.4 13.1,53.2 13.1,54.1 13.1,55 17.4,55 17.4,54.1 17.4,53.2 17.4,52.4 17.4,51.4 17.4,50.6 17.4,49.8 16.6,49.8 16.6,50.6 16.6,51.4 16.6,52.4 16.6,53.2 16.6,54.1 16.6,55 15.7,49.8 15.7,50.6 15.7,51.4 15.7,52.4 15.7,53.2 15.7,54.1 15.7,55
  pour Top (no thermals): 0,0 9,0 9,40 18,49 18,80 0,80
  pour Bottom (no thermals): 0,0 9,0 9,40 18,49 18,80 0,80
VIOUT  (via drill 0.35)
  Bottom 0.508: U$1.12 47.07,30.86 47.39,30.55 47.39,18.73 JP1.2
  other vias: 47.07,32.41